# EAGLE design motor_driver (EAGLE 6.6.0)
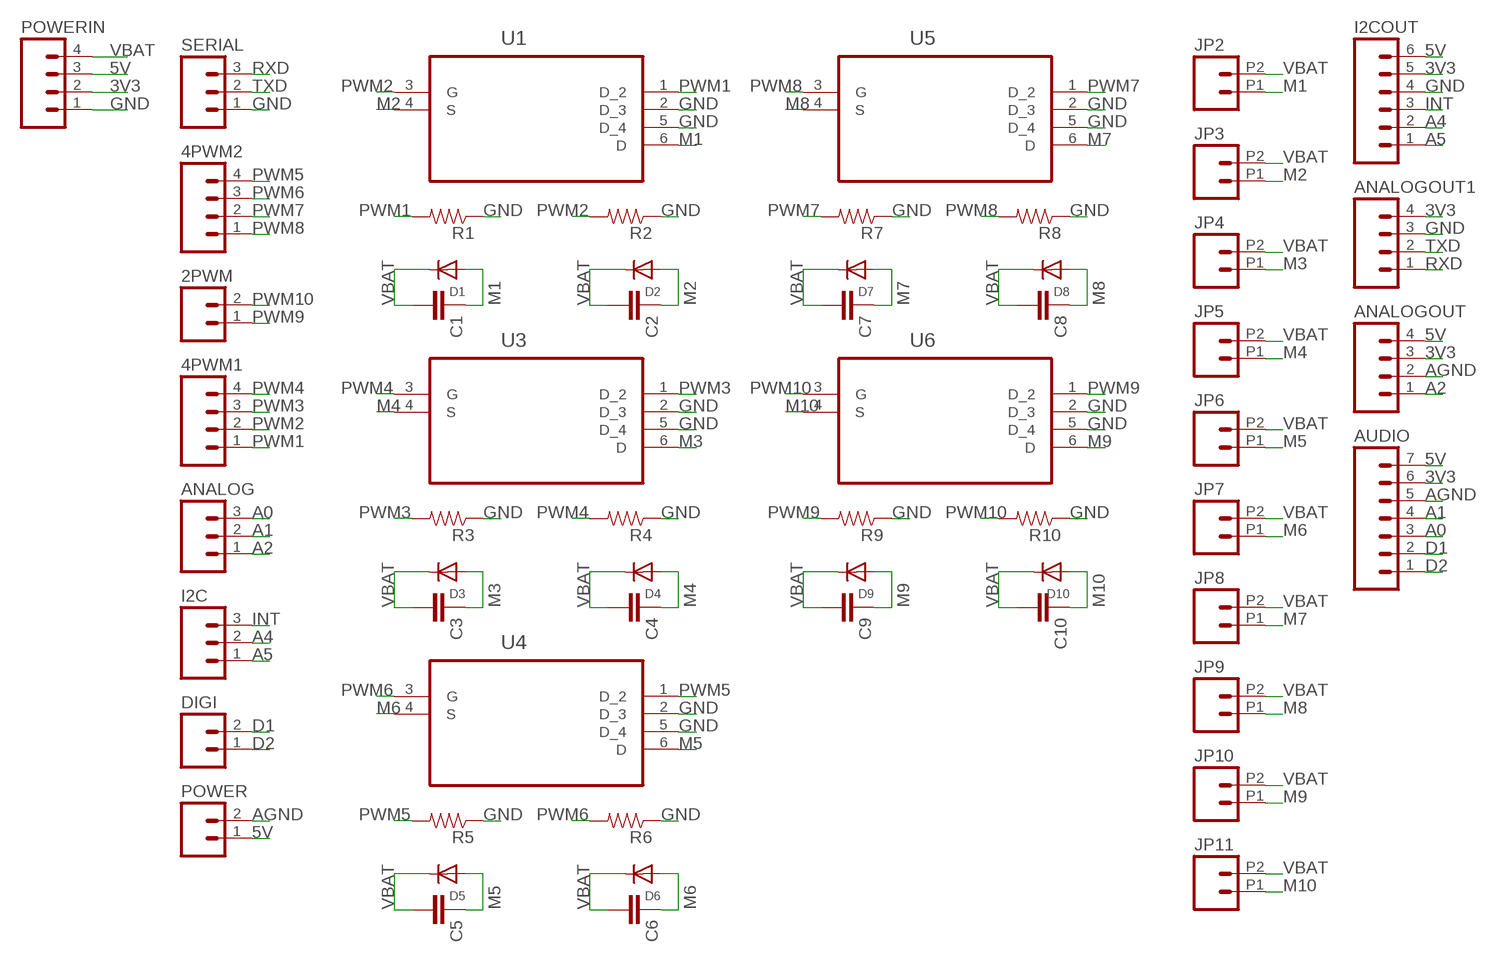
[diagram p0: schematic, sheet 1]

## Parts
2PWM  M02PTH  [1X02]
4PWM1  M04PTH  [1X04]
4PWM2  M04PTH  [1X04]
ANALOG  M03PTH  [1X03]
ANALOGOUT  M04PTH  [1X04]
ANALOGOUT1  M04PTH  [1X04]
AUDIO  M07  [1X07]
C1  CAP0603-CAP  [0603-CAP]
C2  CAP0603-CAP  [0603-CAP]
C3  CAP0603-CAP  [0603-CAP]
C4  CAP0603-CAP  [0603-CAP]
C5  CAP0603-CAP  [0603-CAP]
C6  CAP0603-CAP  [0603-CAP]
C7  CAP0603-CAP  [0603-CAP]
C8  CAP0603-CAP  [0603-CAP]
C9  CAP0603-CAP  [0603-CAP]
C10  CAP0603-CAP  [0603-CAP]
D1  DIODE_SOD-123FL  [SOD-123FL]
D2  DIODE_SOD-123FL  [SOD-123FL]
D3  DIODE_SOD-123FL  [SOD-123FL]
D4  DIODE_SOD-123FL  [SOD-123FL]
D5  DIODE_SOD-123FL  [SOD-123FL]
D6  DIODE_SOD-123FL  [SOD-123FL]
D7  DIODE_SOD-123FL  [SOD-123FL]
D8  DIODE_SOD-123FL  [SOD-123FL]
D9  DIODE_SOD-123FL  [SOD-123FL]
D10  DIODE_SOD-123FL  [SOD-123FL]
DIGI  M02PTH  [1X02]
I2C  M03PTH  [1X03]
I2COUT  M06NO_SILK  [1X06_NO_SILK]
JP2  M022.54MM_SCREWTERM  [1X02_2.54_SCREWTERM]
JP3  M022.54MM_SCREWTERM  [1X02_2.54_SCREWTERM]
JP4  M022.54MM_SCREWTERM  [1X02_2.54_SCREWTERM]
JP5  M022.54MM_SCREWTERM  [1X02_2.54_SCREWTERM]
JP6  M022.54MM_SCREWTERM  [1X02_2.54_SCREWTERM]
JP7  M022.54MM_SCREWTERM  [1X02_2.54_SCREWTERM]
JP8  M022.54MM_SCREWTERM  [1X02_2.54_SCREWTERM]
JP9  M022.54MM_SCREWTERM  [1X02_2.54_SCREWTERM]
JP10  M022.54MM_SCREWTERM  [1X02_2.54_SCREWTERM]
JP11  M022.54MM_SCREWTERM  [1X02_2.54_SCREWTERM]
POWER  M02PTH  [1X02]
POWERIN  M04PTH  [1X04]
R1  RESISTOR0603  [0603-RES]
R2  RESISTOR0603  [0603-RES]
R3  RESISTOR0603  [0603-RES]
R4  RESISTOR0603  [0603-RES]
R5  RESISTOR0603  [0603-RES]
R6  RESISTOR0603  [0603-RES]
R7  RESISTOR0603  [0603-RES]
R8  RESISTOR0603  [0603-RES]
R9  RESISTOR0603  [0603-RES]
R10  RESISTOR0603  [0603-RES]
SERIAL  M03PTH  [1X03]
U1  SI3456DDV-T1-GE3  [SOT95P285X110-6N]
U3  SI3456DDV-T1-GE3  [SOT95P285X110-6N]
U4  SI3456DDV-T1-GE3  [SOT95P285X110-6N]
U5  SI3456DDV-T1-GE3  [SOT95P285X110-6N]
U6  SI3456DDV-T1-GE3  [SOT95P285X110-6N]

## Nets
3V3: ANALOGOUT1.4 ANALOGOUT.3 AUDIO.6 I2COUT.5 POWERIN.2
5V: ANALOGOUT.4 AUDIO.7 I2COUT.6 POWER.1 POWERIN.3
A0: ANALOG.3 AUDIO.3
A1: ANALOG.2 AUDIO.4
A2: ANALOG.1 ANALOGOUT.1
A4: I2C.2 I2COUT.2
A5: I2C.1 I2COUT.1
AGND: ANALOGOUT.2 AUDIO.5 POWER.2
D1: AUDIO.2 DIGI.2
D2: AUDIO.1 DIGI.1
GND: ANALOGOUT1.3 I2COUT.4 POWERIN.1 R1.1 R2.1 R3.1 R4.1 R5.1 R6.1 R7.1 R8.1 R9.1 R10.1 SERIAL.1 U1.2(D_3) U1.5(D_4) U3.2(D_3) U3.5(D_4) U4.2(D_3) U4.5(D_4) U5.2(D_3) U5.5(D_4) U6.2(D_3) U6.5(D_4)
INT: I2C.3 I2COUT.3
M1: C1.1 D1.A JP2.P1 U1.6(D)
M2: C2.1 D2.A JP3.P1 U1.4(S)
M3: C3.1 D3.A JP4.P1 U3.6(D)
M4: C4.1 D4.A JP5.P1 U3.4(S)
M5: C5.1 D5.A JP6.P1 U4.6(D)
M6: C6.1 D6.A JP7.P1 U4.4(S)
M7: C7.1 D7.A JP8.P1 U5.6(D)
M8: C8.1 D8.A JP9.P1 U5.4(S)
M9: C9.1 D9.A JP10.P1 U6.6(D)
M10: C10.1 D10.A JP11.P1 U6.4(S)
PWM1: 4PWM1.1 R1.2 U1.1(D_2)
PWM2: 4PWM1.2 R2.2 U1.3(G)
PWM3: 4PWM1.3 R3.2 U3.1(D_2)
PWM4: 4PWM1.4 R4.2 U3.3(G)
PWM5: 4PWM2.4 R5.2 U4.1(D_2)
PWM6: 4PWM2.3 R6.2 U4.3(G)
PWM7: 4PWM2.2 R7.2 U5.1(D_2)
PWM8: 4PWM2.1 R8.2 U5.3(G)
PWM9: 2PWM.1 R9.2 U6.1(D_2)
PWM10: 2PWM.2 R10.2 U6.3(G)
RXD: ANALOGOUT1.1 SERIAL.3
TXD: ANALOGOUT1.2 SERIAL.2
VBAT: C1.2 C2.2 C3.2 C4.2 C5.2 C6.2 C7.2 C8.2 C9.2 C10.2 D1.C D2.C D3.C D4.C D5.C D6.C D7.C D8.C D9.C D10.C JP2.P2 JP3.P2 JP4.P2 JP5.P2 JP6.P2 JP7.P2 JP8.P2 JP9.P2 JP10.P2 JP11.P2 POWERIN.4

## Library data of the parts
2PWM DIGI JP2-JP11 POWER = SparkFun-Connectors:M02: Standard 2-pin 0.1" header. Use with - straight break away headers ( PRT-00116) - right angle break away headers (PRT-00553) - swiss pins (PRT-00743) - machine pins (PRT-00117) - female headers (PRT-00115) Molex polarized connector foot print use with: PRT-08233 with associated crimp pins and housings. 2.54_SCREWTERM for use with PRT-10571. 3.5mm Screw Terminal footprints for PRT-08084 5mm Screw Terminal footprints for use with PRT-08433
4PWM1 4PWM2 ANALOGOUT ANALOGOUT1 POWERIN = SparkFun-Connectors:M04: Header 4 Standard 4-pin 0.1" header. Use with straight break away headers (SKU : PRT-00116), right angle break away headers (PRT-00553), swiss pins (PRT-00743), machine pins (PRT-00117), and female headers (PRT-00115). Molex polarized connector foot print use with SKU : PRT-08231 with associated crimp pins and housings. 1MM SMD Version SKU: PRT-10208
ANALOG I2C SERIAL = SparkFun-Connectors:M03: Header 3 Standard 3-pin 0.1" header. Use with straight break away headers (SKU : PRT-00116), right angle break away headers (PRT-00553), swiss pins (PRT-00743), machine pins (PRT-00117), and female headers (PRT-00115). Molex polarized connector foot print use with SKU : PRT-08232 with associated crimp pins and housings.
AUDIO = SparkFun-Connectors:M07: Header 7 Standard 7-pin 0.1" header. Use with straight break away headers (SKU : PRT-00116), right angle break away headers (PRT-00553), swiss pins (PRT-00743), machine pins (PRT-00117), and female headers (PRT-00115). NOTES ON THE VARIANTS LOCK and LOCK_LONGPADS... This footprint was designed to help hold the alignment of a through-hole component (i.e. 7-pin header) while soldering it into place. You may notice that each hole has been shifted either up or down by 0.005 of an inch from it's more standard position (which is usually a perfectly straight line). This slight alteration caused the pins (the squares in the middle) to touch the edges of the holes. Because they are alternating, it causes a "brace" to hold the header in place. 0.005 has proven to be the perfect amount of "off-center" position when using our standard breakaway headers. Although looks a little odd when you look at the bare footprint, once you have a header in there, the alteration is very hard to notice. Also, if you push a header all the way into place, it is covered up entirely on the bottom side. This idea of altering the position of holes to aid alignment will be further integrated into the Sparkfun Library for other footprints. It can help hold any component with 3 or more connection pins.
C1-C10 = SparkFun-Capacitors:CAP: Capacitor Standard 0603 ceramic capacitor, and 0.1" leaded capacitor.
D1-D10 = adafruit:DIODE: Diode SMADIODE - SMA Surface Mount Package 20V 1A Schottky Diode Digikey: 641-1014-6-ND DO-1N4148 - Through Hole Small Current Diode SOD-123 20V 1 A (.5mV Vf) Schottky Diode - Digikey: MBRX120TPMSCT-ND SOD-323 10V 570mA (.38mV Vf, 3ns) Schottky Diode - Digikey: ZLLS410CT-ND SOD-523 30V 30mA Schottky Diode (RB751S-40TE61) - Digikey: RB751S-40TE61CT-ND SOT23-R/W - SOT23 Package (R = Solder Paste/Reflow Ovens, W = Hand-Soldering) BAT54Film 40V 300mA - Digikey: 497-7162-1-ND
I2COUT = SparkFun-Connectors:M06: Header 6 Standard 6-pin 0.1" header. Use with straight break away headers (SKU : PRT-00116), right angle break away headers (PRT-00553), swiss pins (PRT-00743), machine pins (PRT-00117), and female headers (PRT-00115). Molex polarized connector foot print use with SKU : PRT-08094 with associated crimp pins and housings. NOTES ON THE VARIANTS LOCK and LOCK_LONGPADS... This footprint was designed to help hold the alignment of a through-hole component (i.e. 6-pin header) while soldering it into place. You may notice that each hole has been shifted either up or down by 0.005 of an inch from it's more standard position (which is a perfectly straight line). This slight alteration caused the pins (the squares in the middle) to touch the edges of the holes. Because they are alternating, it causes a "brace" to hold the component in place. 0.005 has proven to be the perfect amount of "off-center" position when using our standard breakaway headers. Although looks a little odd when you look at the bare footprint, once you have a header in there, the alteration is very hard to notice. Also,if you push a header all the way into place, it is covered up entirely on the bottom side. This idea of altering the position of holes to aid alignment will be further integrated into the Sparkfun Library for other footprints. It can help hold any component with 3 or more connection pins.
R1-R10 = SparkFun-Resistors:RESISTOR: Resistor Basic schematic elements and footprints for 0603, 1206, and PTH resistors.
U1 U3-U6 = Vishay_By_element14_Batch_1:SI3456DDV-T1-GE3: N-Channel 30-V (D-S) MOSFET; MPN: SI3456DDV-T1-GE3; OC_FARNELL: 1840419; OC_NEWARK: 90R9126; PACKAGE: TSOP-6; SUPPLIER: Vishay Siliconix

## Board
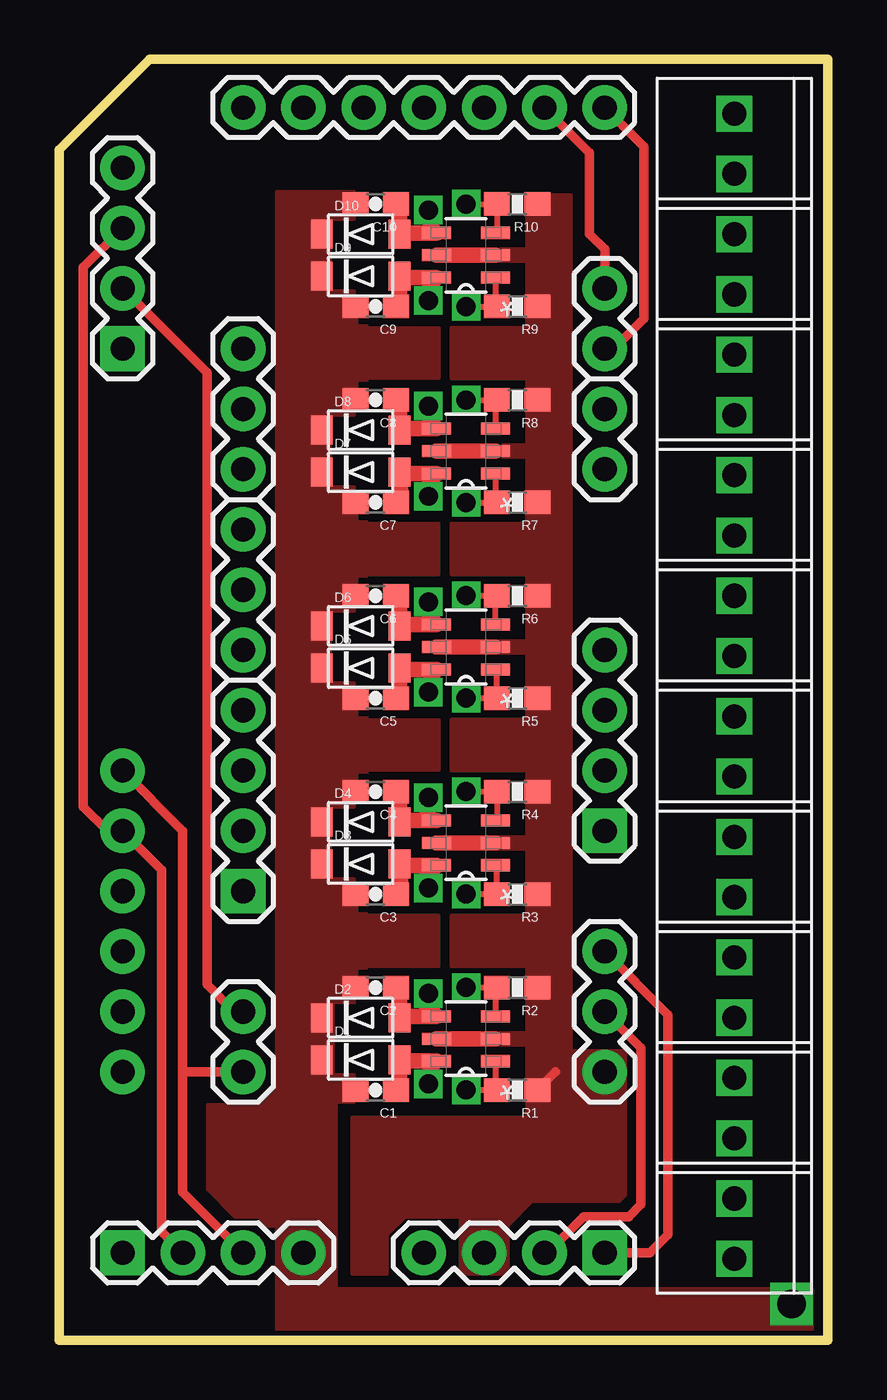
[diagram p1: board, top side]
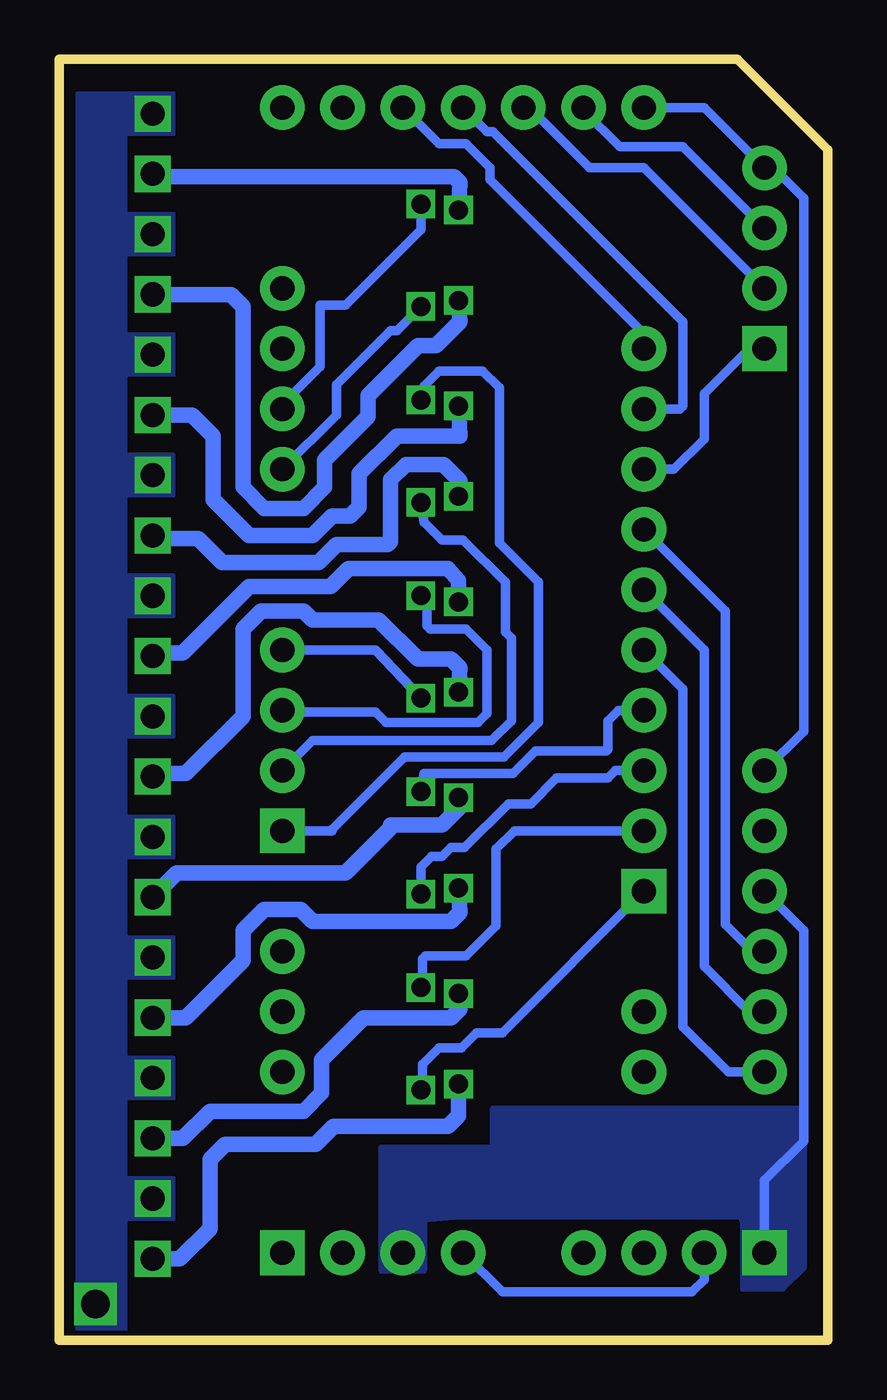
[diagram p2: board, bottom side, seen from below]

Size 32.39 x 53.97 mm. Coordinates in mm from the lower left corner, seen from the top.
Outline: 32.39,0 32.39,53.97 3.81,53.97 0,50.16 0,0 32.39,0
Copper layers (1*16): Top 0.035559375mm / dielectric 1.501140625mm / Bottom 0.035559375mm
Design rules "lpkf-strict": minimum track width 4mil, minimum drill 0.39878125mm, track to track 4mil, track to pad 4mil, pad to pad 4mil, via to via 8mil, smd to smd 4mil, copper to edge 8mil, drill to drill 8mil, minimum pad ring 10mil, minimum via ring 8mil, stop-mask expansion 4mil, vias tented up to drill 0mil, thermal gap 10mil

### Footprints (pad centres in the part's own frame; a part is rotated, then mirrored left to right if it is on the bottom)
1X02 = drill 1.016 pad 1.88: 1 0,0; 2 2.54,0
1X04 = drill 1.016 pad 1.88 square: 1 0,0 | drill 1.016 pad 1.88: 2 2.54,0; 3 5.08,0; 4 7.62,0
1X03 = drill 1.016 pad 1.88: 1 0,0; 2 2.54,0; 3 5.08,0
1X07 = drill 1.016 pad 1.88: 1 0,0; 2 2.54,0; 3 5.08,0; 4 7.62,0; 5 10.16,0; 6 12.7,0; 7 15.24,0
0603-CAP = smd 1.1 x 1: 1 -0.85,0; 2 0.85,0
SOD-123FL = smd 0.91 x 1.22: A 1.637,0; C -1.637,0
1X06_NO_SILK = drill 1.016 pad 1.88: 1 0,0; 2 2.54,0; 3 5.08,0; 4 7.62,0; 5 10.16,0; 6 12.7,0
1X02_2.54_SCREWTERM = drill 1.016 square: P1 2.54,0; P2 0,0
0603-RES = smd 1.1 x 1: 1 -0.85,0; 2 0.85,0
SOT95P285X110-6N = smd 1.219 x 0.508: 1 -1.245,0.94; 2 -1.245,0; 3 -1.245,-0.94; 4 1.245,-0.94; 5 1.245,0; 6 1.245,0.94

### Placement (x,y rotation side)
2PWM  22.99,36.7 90 top
4PWM1  7.75,18.92 90 top
4PWM2  22.99,21.46 90 top
ANALOG  7.75,36.7 90 top
ANALOGOUT  2.67,41.78 90 top
ANALOGOUT1  22.99,3.68 180 top
AUDIO  22.99,51.94 180 top
C1  13.33,10.54 180 top
C2  13.33,14.86 180 top
C3  13.33,18.8 180 top
C4  13.33,23.11 180 top
C5  13.33,27.05 180 top
C6  13.33,31.37 180 top
C7  13.33,35.31 180 top
C8  13.33,39.62 180 top
C9  13.33,43.56 180 top
C10  13.33,47.88 180 top
D1  12.7,11.81 0 top
D2  12.7,13.59 0 top
D3  12.7,20.07 0 top
D4  12.7,21.84 0 top
D5  12.7,28.32 0 top
D6  12.7,30.1 0 top
D7  12.7,36.58 0 top
D8  12.7,38.35 0 top
D9  12.7,44.83 0 top
D10  12.7,46.61 0 top
DIGI  22.99,41.78 90 top
I2C  7.75,29.08 90 top
I2COUT  2.67,11.3 90 top
JP2  28.45,5.97 270 top
JP3  28.45,11.05 270 top
JP4  28.45,16.13 270 top
JP5  28.45,21.21 270 top
JP6  28.45,26.29 270 top
JP7  28.45,31.37 270 top
JP8  28.45,36.45 270 top
JP9  28.45,41.53 270 top
JP10  28.45,46.61 270 top
JP11  28.45,51.69 270 top
POWER  7.75,11.3 90 top
POWERIN  2.67,3.68 0 top
R1  19.3,10.54 180 top
R2  19.3,14.86 180 top
R3  19.3,18.8 180 top
R4  19.3,23.11 180 top
R5  19.3,27.05 180 top
R6  19.3,31.37 180 top
R7  19.3,35.31 180 top
R8  19.3,39.62 180 top
R9  19.3,43.56 180 top
R10  19.3,47.88 180 top
SERIAL  22.99,11.3 90 top
U1  17.14,12.7 180 top
U3  17.14,20.96 180 top
U4  17.14,29.21 180 top
U5  17.14,37.47 180 top
U6  17.14,45.72 180 top

### Tracks (layer width: path | path; a pad name or v marks a point on that pad's centre or on a via)
3V3
  Top 0.406: POWERIN.2 4.32,4.57 4.32,19.81 I2COUT.5 2.03,21.46 1.02,22.48 1.02,45.21 ANALOGOUT.3
  Bottom 0.406: AUDIO.6 10.29,51.82 8.76,50.29 6.1,50.29 ANALOGOUT.3 | POWERIN.2 5.21,2.54 5.71,2.03 13.72,2.03 ANALOGOUT1.4
5V
  Top 0.406: I2COUT.6 5.21,21.46 5.21,11.43 | 5.21,11.43 5.21,6.22 POWERIN.3 | POWER.1 5.33,11.3 5.21,11.43
  Bottom 0.406: AUDIO.7 5.21,51.94 ANALOGOUT.4 2.29,49.4 1.02,48.13 1.02,25.65 I2COUT.6
A0
  Bottom 0.406: ANALOG.3 7.75,42.42 14.22,48.89 14.22,49.4 15.24,50.42 16.38,50.42 AUDIO.3
A1
  Bottom 0.406: ANALOG.2 6.22,39.24 6.1,39.37 6.1,42.93 14.1,50.93 14.35,50.93 AUDIO.4
A2
  Bottom 0.406: ANALOGOUT.1 3.3,41.78 5.21,39.88 5.21,37.97 6.48,36.7 ANALOG.1
A4
  Bottom 0.406: I2COUT.2 3.3,13.84 5.21,15.75 5.21,29.08 I2C.2
A5
  Bottom 0.406: I2COUT.1 4.19,11.3 6.1,13.21 6.1,27.43 I2C.1
AGND
  Top 0.406: POWER.2 7.37,13.84 6.22,14.99 6.22,40.77 ANALOGOUT.2
  Bottom 0.406: AUDIO.5 12.57,51.94 10.03,49.4 7.75,49.4 ANALOGOUT.2
D1
  Top 0.406: DIGI.2 22.99,45.97 22.35,46.61 22.35,50.04 AUDIO.2
D2
  Top 0.406: DIGI.1 23.37,41.78 24.64,43.05 24.64,50.29 AUDIO.1
GND
  Top 0.406: 20.92,11.3 R1.1
  Top 0.653: U1.5 U1.2 | U3.5 U3.2 | U4.2 U4.5 | U5.2 U5.5 | U6.5 U6.2
  Top 0.889: R10.1 20.07,47.88
  Bottom 0.406: POWERIN.1 2.67,6.73 1.02,8.38 1.02,17.27 I2COUT.4
  pour Top (no thermals): 19.68,48.26 19.68,45.97 18.54,45.97 18.54,45.47 19.68,45.47 19.68,42.67 16.51,42.67 16.51,40.51 19.68,40.51 19.68,37.72 18.67,37.72 18.67,37.21 19.68,37.21 19.68,34.42 16.51,34.42 16.51,32.26 19.68,32.26 19.68,29.46 18.54,29.46 18.54,28.96 19.68,28.96 19.68,26.16 16.51,26.16 16.51,24 19.68,24 19.68,21.21 18.42,21.21 18.42,20.7 19.68,20.7 19.68,17.91 16.51,17.91 16.51,15.75 19.68,15.75 19.68,12.95 18.54,12.95 18.54,12.45 19.68,12.45 19.68,9.4 12.32,9.4 12.32,2.79 13.84,2.79 13.84,4.44 14.61,5.21 16.89,5.21 16.89,2.79 18.92,2.79 18.92,4.83 19.94,5.84 23.62,5.84 23.88,6.1 23.88,12.19 21.59,12.19 21.59,48.26
  pour Bottom (no thermals): 18.8,2.92 18.8,8.13 14.1,8.13 14.1,9.78 1.02,9.78 1.02,3.05 1.9,2.16 3.56,2.16 3.56,4.95 3.68,5.21 15.49,5.21 17.02,5.08 17.02,2.92
INT
  Bottom 0.406: I2COUT.3 3.18,16.38 4.32,17.53 4.32,30.73 I2C.3
M1  (via drill 0.8)
  Top 0.653: C1.1 14.34,10.69 D1.A 14.39,11.76 U1.6 15.62,11.48 v15.56,10.79
  Bottom 0.653: v15.56,10.79 15.56,9.46 16,9.02 20.83,9.02 21.59,8.25 25.4,8.25 26.04,7.62 26.04,4.7 27.3,3.43 JP2.P1
M2  (via drill 0.8)
  Top 0.653: C2.1 14.34,14.71 D2.A 14.39,13.64 U1.4 15.49,14.05 v15.56,14.6
  Bottom 0.653: v15.56,14.6 15.49,13.97 15.87,13.59 19.56,13.59 21.34,11.81 21.34,10.41 22.1,9.65 26.04,9.65 27.18,8.51 JP3.P1
M3  (via drill 0.8)
  Top 0.653: 14.39,20.01 D3.A | 14.39,20.01 14.39,19 C3.1 | 14.39,20.01 U3.6 15.49,19.61 v15.56,19.05
  Bottom 0.653: v15.56,19.05 15.49,18.03 15.87,17.65 21.72,17.65 22.22,18.16 23.75,18.16 24.64,17.27 24.64,16 27.05,13.59 JP4.P1
M4  (via drill 0.8)
  Top 0.653: C4.1 14.34,22.96 D4.A 14.39,21.89 U3.4 15.49,21.92 v15.56,22.86
  Bottom 0.653: v15.56,22.86 15.49,22.48 16.26,21.72 18.42,21.72 18.42,21.59 20.32,19.68 27.43,19.68 JP5.P1
M5  (via drill 0.8)
  Top 0.653: C5.1 14.34,27.2 D5.A 14.39,28.27 U4.6 15.68,27.99 v15.56,27.3
  Bottom 0.653: v15.56,27.3 15.49,28.32 15.87,28.7 17.27,28.7 18.92,30.35 21.72,30.35 22.1,30.73 23.88,30.73 24.64,29.97 24.64,26.29 27.05,23.88 28.32,23.88 JP6.P1
M6  (via drill 0.8)
  Top 0.653: C6.1 14.34,31.22 D6.A 14.39,30.15 U4.4 15.62,30.43 v15.56,31.11
  Bottom 0.653: v15.56,31.11 15.56,32 16,32.51 20.19,32.51 20.96,31.75 24.38,31.75 27.18,28.96 28.32,28.96 JP7.P1
M7  (via drill 0.8)
  Top 0.653: 14.39,36.52 U5.6 15.62,36.25 v15.56,35.56 | 14.39,36.52 D7.A | 14.39,36.52 14.39,35.51 C7.1
  Bottom 0.653: v15.56,35.56 15.49,36.19 16.19,36.89 17.78,36.89 18.42,36.26 18.42,33.66 18.54,33.53 20.7,33.53 21.46,32.77 25.53,32.77 26.54,33.78 28.32,33.78 JP8.P1
M8  (via drill 0.8)
  Top 0.653: C8.1 14.34,39.47 D8.A 14.39,38.41 U5.4 15.62,38.68 v15.56,39.37
  Bottom 0.653: v15.56,39.37 15.49,38.1 18.16,38.1 19.75,36.51 19.75,35.12 20.13,34.73 20.89,34.73 21.72,33.91 24.38,33.91 25.91,35.43 25.91,38.1 26.8,38.99 JP9.P1
M9  (via drill 0.8)
  Top 0.653: C9.1 14.34,43.71 D9.A 14.39,44.78 U6.6 15.62,44.5 v15.56,43.81
  Bottom 0.653: v15.56,43.81 15.49,42.93 16.51,41.91 17.27,41.91 19.37,39.81 19.37,38.92 21.21,37.08 21.21,35.94 22.1,35.05 23.75,35.05 24.64,35.94 24.64,43.56 25.15,44.07 JP10.P1
M10  (via drill 0.8 pad 0.81)
  Top 0.653: C10.1 14.34,47.73 D10.A 14.39,46.66 U6.4 15.62,46.94 v15.56,47.62
  Bottom 0.653: v15.56,47.62 15.49,48.77 15.75,49.02 28.32,49.02 JP11.P1
PWM1  (via drill 0.8)
  Top 0.254: v17.14,10.54 R1.2 | U1.1 18.39,10.6
  Top 0.653: 18.39,10.6 R1.2
  Bottom 0.406: 4PWM1.1 13.72,12.95 14.8,12.95 15.43,12.32 16.38,12.32 17.08,11.62 17.08,10.6 v17.14,10.54
PWM2  (via drill 0.8)
  Top 0.254: v17.14,14.86 R2.2 | 18.39,14.79 U1.3
  Top 0.653: 18.39,14.79 R2.2
  Bottom 0.406: 4PWM1.2 13.21,21.46 13.97,20.7 13.97,17.46 15.24,16.19 16.96,16.19 17.08,16.07 17.08,14.92 v17.14,14.86
PWM3  (via drill 0.8)
  Top 0.254: v17.14,18.8 R3.2 18.45,19.95 U3.1
  Bottom 0.406: v17.14,18.8 17.14,19.94 16.7,20.38 16.26,20.38 15.87,20.76 15.3,20.76 13.46,22.61 12.51,22.61 11.43,23.69 9.27,23.69 8.95,24 4PWM1.3
PWM4  (via drill 0.8)
  Top 0.254: v17.14,23.11 R4.2 18.45,21.96 U3.3
  Bottom 0.254: 9.27,24.89 9.33,24.83
  Bottom 0.406: 4PWM1.4 8.83,26.54 9.27,26.1 9.27,24.89 | 9.33,24.83 12.32,24.83 13.27,23.88 17.02,23.88 v17.14,23.11
PWM5  (via drill 0.8)
  Top 0.254: U4.1 18.45,28.21 R5.2 v17.14,27.05
  Top 0.653: 18.39,27.11 R5.2
  Bottom 0.406: 4PWM2.4 19.05,29.08 v17.14,27.05
PWM6  (via drill 0.8)
  Top 0.254: U4.3 18.39,31.3 | v17.14,31.37 R6.2
  Top 0.653: 18.39,31.3 R6.2
  Bottom 0.254: 16.76,29.97 16.89,30.1 | 22.92,26.48 4PWM2.3
  Bottom 0.406: 16.76,29.97 15.24,29.97 14.35,29.08 14.35,26.42 14.73,26.04 18.61,26.04 19.05,26.48 22.92,26.48 | 16.89,30.1 16.89,31.24 v17.14,31.37
PWM7  (via drill 0.8)
  Top 0.254: v17.14,35.31 R7.2 | U5.1 18.39,35.37
  Top 0.653: 18.39,35.37 R7.2
  Bottom 0.406: v17.14,35.31 17.02,34.48 16.26,33.72 15.37,33.72 13.59,31.94 13.59,29.84 13.33,29.59 13.33,26.1 14.16,25.27 21.72,25.27 4PWM2.2
PWM8  (via drill 0.8)
  Top 0.254: 18.39,39.56 U5.3 | v17.14,39.62 R8.2
  Top 0.653: 18.39,39.56 R8.2
  Bottom 0.254: 20.89,21.46 20.89,21.53
  Bottom 0.406: v17.14,39.62 17.02,40.2 16.38,40.83 14.54,40.83 13.84,40.13 13.84,33.59 12.19,31.94 12.19,26.04 13.65,24.57 17.84,24.57 20.89,21.53 | 20.89,21.46 4PWM2.1
PWM9  (via drill 0.8)
  Top 0.254: v17.14,43.56 R9.2 | U6.1 18.39,43.62
  Top 0.653: 18.39,43.62 R9.2
  Bottom 0.406: 2PWM.1 20.7,38.99 20.7,40.26 18.42,42.55 18.16,42.55 v17.14,43.56
PWM10  (via drill 0.8 pad 0.81)
  Top 0.254: v17.14,47.88 R10.2 18.45,46.72 U6.3
  Top 0.653: 18.39,47.81 R10.2
  Bottom 0.406: 2PWM.2 22.99,39.43 21.4,41.02 21.4,43.62 20.32,43.62 17.14,46.8 v17.14,47.88
RXD
  Top 0.406: ANALOGOUT1.1 24.89,3.68 25.65,4.44 25.65,13.72 SERIAL.3
TXD
  Top 0.406: ANALOGOUT1.2 20.57,3.68 22.1,5.21 24,5.21 24.51,5.71 24.51,12.32 SERIAL.2
VBAT  (via drill 1.2)
  other vias: 30.86,1.52
  pour Top (no thermals): 12.45,10.03 12.45,11.18 11.56,11.18 11.56,14.22 12.45,14.22 12.45,19.43 11.43,19.43 11.43,22.48 12.45,22.48 12.45,27.69 11.43,27.69 11.43,30.73 12.45,30.73 12.45,35.94 11.43,35.94 11.43,38.99 12.45,38.99 12.45,44.2 11.43,44.2 11.43,47.24 12.45,47.24 12.45,48.39 9.14,48.39 9.14,10.54 8.51,9.91 6.22,9.91 6.22,6.35 7.37,5.21 8.38,5.21 8.76,4.83 9.14,4.83 9.14,0.38 31.75,0.38 31.75,2.16 11.68,2.16 11.68,10.03
  pour Top: 12.95,43.56 12.95,42.67 16,42.67 16,40.51 12.95,40.51 12.95,39.62 12.45,39.62 12.45,43.56
  pour Top: 12.45,35.31 12.45,31.37 12.95,31.37 12.95,32.26 16,32.26 16,34.42 12.95,34.42 12.95,35.31
  pour Top: 12.45,23.11 12.45,27.05 12.95,27.05 12.95,26.16 16,26.16 16,24 12.95,24 12.95,23.11
  pour Top: 12.45,18.8 12.45,14.86 12.95,14.86 12.95,15.75 16,15.75 16,17.91 12.95,17.91 12.95,18.8
  pour Bottom (no thermals): 27.56,47.5 27.56,45.72 29.59,45.72 29.59,42.42 27.56,42.42 27.56,40.64 29.59,40.64 29.59,37.34 27.56,37.34 27.56,35.56 29.59,35.56 29.59,32.26 27.56,32.26 27.56,30.48 29.59,30.48 29.59,27.18 27.56,27.18 27.56,25.4 29.59,25.4 29.59,22.1 27.56,22.1 27.56,20.32 29.59,20.32 29.59,17.02 27.56,17.02 27.56,15.24 29.59,15.24 29.59,11.94 27.56,11.94 27.56,10.16 29.59,10.16 29.59,6.86 27.56,6.86 27.56,5.08 29.59,5.08 29.59,0.38 31.62,0.38 31.62,52.58 27.56,52.58 27.56,50.8 29.59,50.8 29.59,47.5